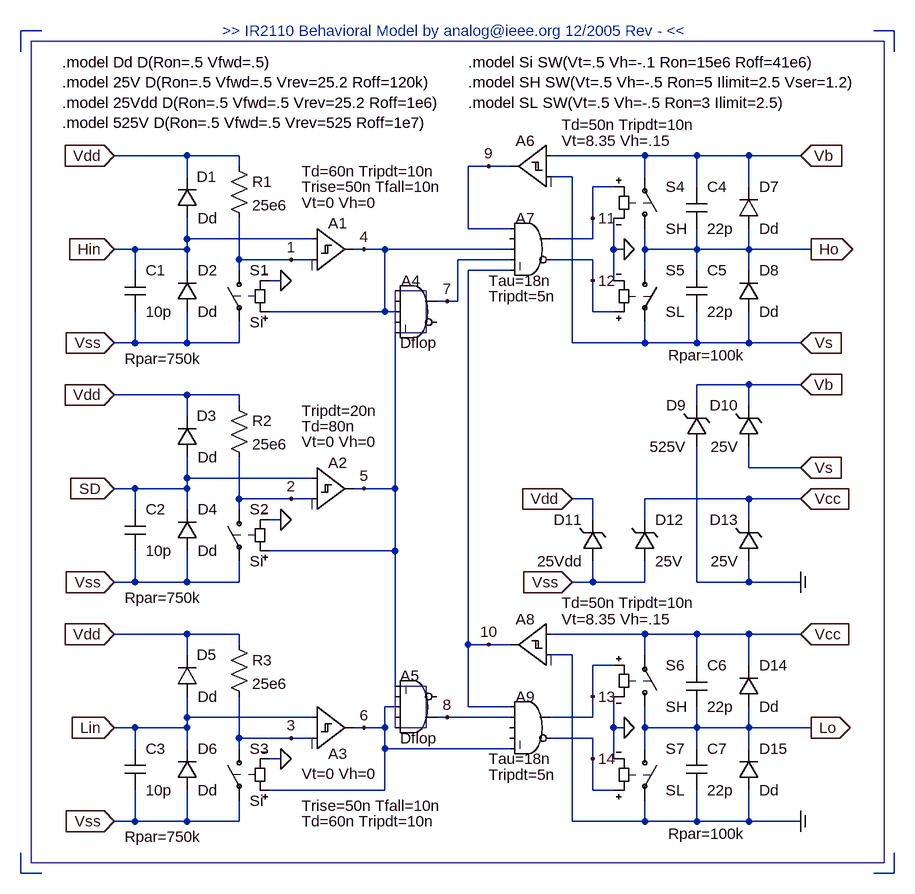
[diagram p0: schematic IR2110.asc]
IR2110.asc, the LTspice schematic file:
Version 4
SHEET 1 13828 1048
WIRE -496 -592 -496 -624
WIRE -496 672 -496 640
WIRE -464 -624 -496 -624
WIRE -464 672 -496 672
WIRE -320 -288 -352 -288
WIRE -320 -256 -320 -288
WIRE -320 -144 -352 -144
WIRE -320 -144 -320 -192
WIRE -320 80 -352 80
WIRE -320 112 -320 80
WIRE -320 224 -352 224
WIRE -320 224 -320 176
WIRE -320 448 -352 448
WIRE -320 480 -320 448
WIRE -320 592 -352 592
WIRE -320 592 -320 544
WIRE -240 -432 -352 -432
WIRE -240 -400 -240 -432
WIRE -240 -304 -240 -336
WIRE -240 -288 -320 -288
WIRE -240 -288 -240 -304
WIRE -240 -256 -240 -288
WIRE -240 -144 -320 -144
WIRE -240 -144 -240 -192
WIRE -240 -64 -352 -64
WIRE -240 -32 -240 -64
WIRE -240 64 -240 32
WIRE -240 80 -320 80
WIRE -240 80 -240 64
WIRE -240 112 -240 80
WIRE -240 224 -320 224
WIRE -240 224 -240 176
WIRE -240 304 -352 304
WIRE -240 336 -240 304
WIRE -240 432 -240 400
WIRE -240 448 -320 448
WIRE -240 448 -240 432
WIRE -240 480 -240 448
WIRE -240 592 -320 592
WIRE -240 592 -240 544
WIRE -160 -432 -240 -432
WIRE -160 -416 -160 -432
WIRE -160 -272 -160 -336
WIRE -160 -256 -160 -272
WIRE -160 -144 -240 -144
WIRE -160 -144 -160 -176
WIRE -160 -64 -240 -64
WIRE -160 -48 -160 -64
WIRE -160 96 -160 32
WIRE -160 112 -160 96
WIRE -160 224 -240 224
WIRE -160 224 -160 192
WIRE -160 304 -240 304
WIRE -160 320 -160 304
WIRE -160 464 -160 400
WIRE -160 480 -160 464
WIRE -160 592 -240 592
WIRE -160 592 -160 560
WIRE -96 -240 -112 -240
WIRE -96 128 -112 128
WIRE -96 496 -112 496
WIRE -80 -272 -160 -272
WIRE -80 96 -160 96
WIRE -80 464 -160 464
WIRE -48 -304 -240 -304
WIRE -48 -272 -80 -272
WIRE -48 64 -240 64
WIRE -48 96 -80 96
WIRE -48 432 -240 432
WIRE -48 464 -80 464
WIRE 32 -288 16 -288
WIRE 32 80 16 80
WIRE 32 448 16 448
WIRE 64 -288 32 -288
WIRE 64 -192 -112 -192
WIRE 64 -192 64 -288
WIRE 64 448 32 448
WIRE 64 448 64 416
WIRE 64 480 64 448
WIRE 64 544 -112 544
WIRE 64 544 64 480
WIRE 80 -192 64 -192
WIRE 80 80 32 80
WIRE 80 80 80 -160
WIRE 80 176 -112 176
WIRE 80 176 80 80
WIRE 80 384 80 176
WIRE 80 416 64 416
WIRE 160 -208 144 -208
WIRE 160 432 144 432
WIRE 176 -208 160 -208
WIRE 176 -208 176 -272
WIRE 192 -320 192 -416
WIRE 192 320 192 -256
WIRE 192 416 192 320
WIRE 224 -416 192 -416
WIRE 224 320 192 320
WIRE 256 -416 224 -416
WIRE 256 -320 192 -320
WIRE 256 -288 64 -288
WIRE 256 -272 176 -272
WIRE 256 -256 192 -256
WIRE 256 320 224 320
WIRE 256 416 192 416
WIRE 256 432 160 432
WIRE 256 480 64 480
WIRE 352 -400 320 -400
WIRE 352 -144 352 -400
WIRE 352 336 320 336
WIRE 352 592 352 336
WIRE 384 -336 384 -384
WIRE 384 -304 320 -304
WIRE 384 -304 384 -336
WIRE 384 -272 320 -272
WIRE 384 -240 384 -272
WIRE 384 -192 384 -240
WIRE 384 96 352 96
WIRE 384 128 384 96
WIRE 384 224 352 224
WIRE 384 224 384 192
WIRE 384 400 384 352
WIRE 384 432 320 432
WIRE 384 432 384 400
WIRE 384 464 320 464
WIRE 384 496 384 464
WIRE 384 544 384 496
WIRE 416 -384 384 -384
WIRE 416 -288 416 -336
WIRE 416 -240 416 -288
WIRE 416 -192 384 -192
WIRE 416 352 384 352
WIRE 416 448 416 400
WIRE 416 496 416 448
WIRE 416 544 384 544
WIRE 432 -288 416 -288
WIRE 432 448 416 448
WIRE 464 -432 320 -432
WIRE 464 -400 464 -432
WIRE 464 -288 464 -320
WIRE 464 -256 464 -288
WIRE 464 -144 352 -144
WIRE 464 -144 464 -176
WIRE 464 128 464 96
WIRE 464 224 384 224
WIRE 464 224 464 192
WIRE 464 304 320 304
WIRE 464 336 464 304
WIRE 464 448 464 416
WIRE 464 480 464 448
WIRE 464 592 352 592
WIRE 464 592 464 560
WIRE 544 -432 464 -432
WIRE 544 -384 544 -432
WIRE 544 -288 464 -288
WIRE 544 -288 544 -320
WIRE 544 -256 544 -288
WIRE 544 -144 464 -144
WIRE 544 -144 544 -192
WIRE 544 -48 544 -80
WIRE 544 224 544 16
WIRE 544 304 464 304
WIRE 544 352 544 304
WIRE 544 448 464 448
WIRE 544 448 544 416
WIRE 544 480 544 448
WIRE 544 592 464 592
WIRE 544 592 544 544
WIRE 624 -432 544 -432
WIRE 624 -384 624 -432
WIRE 624 -288 544 -288
WIRE 624 -288 624 -320
WIRE 624 -256 624 -288
WIRE 624 -144 544 -144
WIRE 624 -144 624 -192
WIRE 624 -80 544 -80
WIRE 624 -48 624 -80
WIRE 624 48 624 16
WIRE 624 96 464 96
WIRE 624 128 624 96
WIRE 624 224 544 224
WIRE 624 224 624 192
WIRE 624 304 544 304
WIRE 624 352 624 304
WIRE 624 448 544 448
WIRE 624 448 624 416
WIRE 624 480 624 448
WIRE 624 592 544 592
WIRE 624 592 624 544
WIRE 704 -432 624 -432
WIRE 704 -144 624 -144
WIRE 704 -80 624 -80
WIRE 704 48 624 48
WIRE 704 96 624 96
WIRE 704 224 624 224
WIRE 704 304 624 304
WIRE 704 592 624 592
WIRE 720 -288 624 -288
WIRE 720 448 624 448
WIRE 848 -624 816 -624
WIRE 848 -592 848 -624
WIRE 848 672 816 672
WIRE 848 672 848 640
FLAG 720 -288 Ho
IOPIN 720 -288 Out
FLAG 704 -432 Vb
IOPIN 704 -432 In
FLAG 704 -144 Vs
IOPIN 704 -144 In
FLAG 704 224 Com
IOPIN 704 224 In
FLAG 704 304 Vcc
IOPIN 704 304 In
FLAG 704 592 Com
IOPIN 704 592 In
FLAG 720 448 Lo
IOPIN 720 448 Out
FLAG 432 448 0
FLAG 432 -288 0
FLAG 160 432 8
FLAG 384 -336 11
FLAG 384 -240 12
FLAG 704 96 Vcc
IOPIN 704 96 In
FLAG 704 -80 Vb
IOPIN 704 -80 In
FLAG 704 48 Vs
IOPIN 704 48 In
FLAG 224 -416 9
FLAG 224 320 10
FLAG -352 -288 Hin
IOPIN -352 -288 In
FLAG -352 -432 Vdd
IOPIN -352 -432 In
FLAG -352 -144 Vss
IOPIN -352 -144 In
FLAG -352 80 SD
IOPIN -352 80 In
FLAG -352 -64 Vdd
IOPIN -352 -64 In
FLAG -352 224 Vss
IOPIN -352 224 In
FLAG -80 -272 1
FLAG -80 464 3
FLAG 32 -288 4
FLAG 32 80 5
FLAG 32 448 6
FLAG -352 448 Lin
IOPIN -352 448 In
FLAG -352 304 Vdd
IOPIN -352 304 In
FLAG -352 592 Vss
IOPIN -352 592 In
FLAG -96 -240 0
FLAG -96 128 0
FLAG -96 496 0
FLAG -80 96 2
FLAG 160 -208 7
FLAG 352 224 Vss
IOPIN 352 224 In
FLAG 352 96 Vdd
IOPIN 352 96 In
FLAG 384 400 13
FLAG 384 496 14
SYMBOL cap -336 -256 R0
WINDOW 0 32 0 Left 0
WINDOW 3 32 64 Left 0
WINDOW 39 0 136 Left 0
SYMATTR InstName C1
SYMATTR Value 10p
SYMATTR SpiceLine Rpar=750k
SYMBOL diode -256 -336 M180
WINDOW 0 31 64 Left 0
WINDOW 3 32 0 Left 0
SYMATTR InstName D1
SYMATTR Value Dd
SYMBOL diode -256 -192 M180
WINDOW 0 32 64 Left 0
WINDOW 3 32 0 Left 0
SYMATTR InstName D2
SYMATTR Value Dd
SYMBOL res -176 -432 R0
SYMATTR InstName R1
SYMATTR Value 25e6
SYMBOL sw -160 -272 M0
WINDOW 0 -16 16 Right 0
WINDOW 3 -16 96 Right 0
SYMATTR InstName S1
SYMATTR Value Si
SYMBOL Digital\\diffschmtbuf -48 -352 R0
WINDOW 0 40 24 Center 0
WINDOW 3 -16 -8 Left 0
WINDOW 123 -16 -32 Left 0
WINDOW 39 -16 -56 Left 0
SYMATTR InstName A1
SYMATTR Value Vt=0 Vh=0
SYMATTR Value2 Trise=50n Tfall=10n
SYMATTR SpiceLine Td=60n Tripdt=10n
SYMBOL cap -336 112 R0
WINDOW 0 32 0 Left 0
WINDOW 3 32 64 Left 0
WINDOW 39 0 136 Left 0
SYMATTR InstName C2
SYMATTR Value 10p
SYMATTR SpiceLine Rpar=750k
SYMBOL diode -256 32 M180
WINDOW 0 31 64 Left 0
WINDOW 3 32 0 Left 0
SYMATTR InstName D3
SYMATTR Value Dd
SYMBOL diode -256 176 M180
WINDOW 0 32 64 Left 0
WINDOW 3 32 0 Left 0
SYMATTR InstName D4
SYMATTR Value Dd
SYMBOL res -176 -64 R0
SYMATTR InstName R2
SYMATTR Value 25e6
SYMBOL sw -160 96 M0
WINDOW 0 -16 16 Right 0
WINDOW 3 -16 96 Right 0
SYMATTR InstName S2
SYMATTR Value Si
SYMBOL Digital\\diffschmtbuf -48 16 R0
WINDOW 3 -16 -8 Left 0
WINDOW 123 -16 -32 Left 0
WINDOW 39 -16 -56 Left 0
WINDOW 0 40 24 Center 0
SYMATTR Value Vt=0 Vh=0
SYMATTR Value2 Td=80n
SYMATTR SpiceLine Tripdt=20n
SYMATTR InstName A2
SYMBOL cap -336 480 R0
WINDOW 0 32 0 Left 0
WINDOW 3 32 64 Left 0
WINDOW 39 0 136 Left 0
SYMATTR InstName C3
SYMATTR Value 10p
SYMATTR SpiceLine Rpar=750k
SYMBOL diode -256 400 M180
WINDOW 0 31 64 Left 0
WINDOW 3 32 0 Left 0
SYMATTR InstName D5
SYMATTR Value Dd
SYMBOL diode -256 544 M180
WINDOW 0 32 64 Left 0
WINDOW 3 32 0 Left 0
SYMATTR InstName D6
SYMATTR Value Dd
SYMBOL res -176 304 R0
SYMATTR InstName R3
SYMATTR Value 25e6
SYMBOL sw -160 464 M0
WINDOW 0 -16 16 Right 0
WINDOW 3 -16 96 Right 0
SYMATTR InstName S3
SYMATTR Value Si
SYMBOL Digital\\diffschmtbuf -48 384 R0
WINDOW 0 40 104 Center 0
WINDOW 3 -16 135 Left 0
WINDOW 123 -16 184 Left 0
WINDOW 39 -16 208 Left 0
SYMATTR InstName A3
SYMATTR Value Vt=0 Vh=0
SYMATTR Value2 Trise=50n Tfall=10n
SYMATTR SpiceLine Td=60n Tripdt=10n
SYMBOL Digital\\and 112 -256 R0
WINDOW 0 -23 16 Left 0
WINDOW 38 -24 112 Left 0
WINDOW 3 -24 136 Left 0
SYMATTR InstName A4
SYMATTR SpiceModel Dflop
SYMBOL Digital\\and 112 480 M180
WINDOW 0 -24 112 Left 0
WINDOW 38 -24 16 Left 0
WINDOW 3 -24 136 Left 0
SYMATTR InstName A5
SYMATTR SpiceModel Dflop
SYMBOL Digital\\diffschmtbuf 320 -480 M0
WINDOW 0 40 25 Center 0
WINDOW 3 -16 25 Right 0
WINDOW 123 -16 0 Right 0
SYMATTR InstName A6
SYMATTR Value Vt=8.35 Vh=.15
SYMATTR Value2 Td=50n Tripdt=10n
SYMBOL Digital\\and 288 -352 R0
WINDOW 0 -8 16 Center 0
WINDOW 3 -64 112 Left 0
WINDOW 123 -64 136 Left 0
SYMATTR InstName A7
SYMATTR Value Tau=18n
SYMATTR Value2 Tripdt=5n
SYMBOL sw 464 -304 M180
WINDOW 0 32 80 Left 0
WINDOW 3 32 16 Left 0
SYMATTR InstName S4
SYMATTR Value SH
SYMBOL sw 464 -272 R0
WINDOW 0 32 16 Left 0
WINDOW 3 32 80 Left 0
SYMATTR InstName S5
SYMATTR Value SL
SYMBOL cap 528 -384 R0
WINDOW 0 32 0 Left 0
WINDOW 3 32 64 Left 0
SYMATTR InstName C4
SYMATTR Value 22p
SYMBOL cap 528 -256 R0
WINDOW 0 32 0 Left 0
WINDOW 3 32 64 Left 0
WINDOW 39 32 131 Center 0
SYMATTR InstName C5
SYMATTR Value 22p
SYMATTR SpiceLine Rpar=100k
SYMBOL diode 608 -320 M180
WINDOW 0 32 64 Left 0
WINDOW 3 32 0 Left 0
SYMATTR InstName D7
SYMATTR Value Dd
SYMBOL diode 608 -192 M180
WINDOW 0 32 64 Left 0
WINDOW 3 32 0 Left 0
SYMATTR InstName D8
SYMATTR Value Dd
SYMBOL zener 528 16 M180
WINDOW 0 0 64 Right 0
WINDOW 3 0 0 Right 0
SYMATTR InstName D9
SYMATTR Value 525V
SYMBOL zener 608 16 M180
WINDOW 0 0 64 Right 0
WINDOW 3 0 0 Right 0
SYMATTR InstName D10
SYMATTR Value 25V
SYMBOL zener 368 192 M180
WINDOW 0 0 64 Right 0
WINDOW 3 0 0 Right 0
SYMATTR InstName D11
SYMATTR Value 25Vdd
SYMBOL zener 448 192 M180
WINDOW 0 32 64 Left 0
WINDOW 3 32 0 Left 0
SYMATTR InstName D12
SYMATTR Value 25V
SYMBOL zener 608 192 M180
WINDOW 0 0 64 Right 0
WINDOW 3 0 0 Right 0
SYMATTR InstName D13
SYMATTR Value 25V
SYMBOL Digital\\diffschmtbuf 320 256 M0
WINDOW 0 40 25 Center 0
WINDOW 3 -16 25 Right 0
WINDOW 123 -16 0 Right 0
SYMATTR InstName A8
SYMATTR Value Vt=8.35 Vh=.15
SYMATTR Value2 Td=50n Tripdt=10n
SYMBOL Digital\\and 288 384 R0
WINDOW 0 -8 16 Center 0
WINDOW 3 -64 112 Left 0
WINDOW 123 -64 136 Left 0
SYMATTR InstName A9
SYMATTR Value Tau=18n
SYMATTR Value2 Tripdt=5n
SYMBOL sw 464 432 M180
WINDOW 0 32 80 Left 0
WINDOW 3 32 16 Left 0
SYMATTR InstName S6
SYMATTR Value SH
SYMBOL sw 464 464 R0
WINDOW 0 32 16 Left 0
WINDOW 3 32 80 Left 0
SYMATTR InstName S7
SYMATTR Value SL
SYMBOL cap 528 352 R0
WINDOW 0 32 0 Left 0
WINDOW 3 32 64 Left 0
SYMATTR InstName C6
SYMATTR Value 22p
SYMBOL cap 528 480 R0
WINDOW 0 32 0 Left 0
WINDOW 3 32 64 Left 0
WINDOW 39 32 131 Center 0
SYMATTR InstName C7
SYMATTR Value 22p
SYMATTR SpiceLine Rpar=100k
SYMBOL diode 608 416 M180
WINDOW 0 32 64 Left 0
WINDOW 3 32 0 Left 0
SYMATTR InstName D14
SYMATTR Value Dd
SYMBOL diode 608 544 M180
WINDOW 0 32 64 Left 0
WINDOW 3 32 0 Left 0
SYMATTR InstName D15
SYMATTR Value Dd
TEXT 176 -624 Center 0 ;>> IR2110 Behavioral Model by analog@ieee.org 12/2005 Rev - <<
TEXT -432 -576 Left 0 !.model Dd D(Ron=.5 Vfwd=.5)\n.model 25V D(Ron=.5 Vfwd=.5 Vrev=25.2 Roff=120k)\n.model 25Vdd D(Ron=.5 Vfwd=.5 Vrev=25.2 Roff=1e6)\n.model 525V D(Ron=.5 Vfwd=.5 Vrev=525 Roff=1e7)
TEXT 192 -576 Left 0 !.model Si SW(Vt=.5 Vh=-.1 Ron=15e6 Roff=41e6)\n.model SH SW(Vt=.5 Vh=-.5 Ron=5 Ilimit=2.5 Vser=1.2)\n.model SL SW(Vt=.5 Vh=-.5 Ron=3 Ilimit=2.5)
RECTANGLE Normal 832 656 -480 -608
RECTANGLE Normal 128 -160 80 -224
RECTANGLE Normal 128 448 80 384

The netlist it stands for:
* IR2110.asc
C1 Hin Vss 10p Rpar=750k
D1 Hin Vdd Dd
D2 Vss Hin Dd
R1 Vdd 1 25e6
S1 1 Vss 4 0 Si
A1 Hin 1 0 0 0 0 4 0 SCHMITT Vt=0 Vh=0 Trise=50n Tfall=10n Td=60n Tripdt=10n
C2 SD Vss 10p Rpar=750k
D3 SD Vdd Dd
D4 Vss SD Dd
R2 Vdd 2 25e6
S2 2 Vss 5 0 Si
A2 SD 2 0 0 0 0 5 0 SCHMITT Vt=0 Vh=0 Td=80n Tripdt=20n
C3 Lin Vss 10p Rpar=750k
D5 Lin Vdd Dd
D6 Vss Lin Dd
R3 Vdd 3 25e6
S3 3 Vss 6 0 Si
A3 Lin 3 0 0 0 0 6 0 SCHMITT Vt=0 Vh=0 Trise=50n Tfall=10n Td=60n Tripdt=10n
A4 0 0 4 0 5 0 7 0 Dflop
A5 0 0 6 0 5 0 8 0 Dflop
A6 Vb Vs 0 0 0 0 9 0 SCHMITT Vt=8.35 Vh=.15 Td=50n Tripdt=10n
A7 9 0 4 7 10 12 11 0 AND Tau=18n Tripdt=5n
S4 Ho Vb 11 0 SH
S5 Ho Vs 12 0 SL
C4 Vb Ho 22p
C5 Ho Vs 22p Rpar=100k
D7 Ho Vb Dd
D8 Vs Ho Dd
D9 Com Vb 525V
D10 Vs Vb 25V
D11 Vss Vdd 25Vdd
D12 Vss Vcc 25V
D13 Com Vcc 25V
A8 Vcc Com 0 0 0 0 10 0 SCHMITT Vt=8.35 Vh=.15 Td=50n Tripdt=10n
A9 10 8 0 0 6 14 13 0 AND Tau=18n Tripdt=5n
S6 Lo Vcc 13 0 SH
S7 Lo Com 14 0 SL
C6 Vcc Lo 22p
C7 Lo Com 22p Rpar=100k
D14 Lo Vcc Dd
D15 Com Lo Dd
.model D D
.lib standard.dio
* >> IR2110 Behavioral Model by analog@ieee.org 12/2005 Rev - <<
.model Dd D(Ron=.5 Vfwd=.5)
.model 25V D(Ron=.5 Vfwd=.5 Vrev=25.2 Roff=120k)
.model 25Vdd D(Ron=.5 Vfwd=.5 Vrev=25.2 Roff=1e6)
.model 525V D(Ron=.5 Vfwd=.5 Vrev=525 Roff=1e7)
.model Si SW(Vt=.5 Vh=-.1 Ron=15e6 Roff=41e6)
.model SH SW(Vt=.5 Vh=-.5 Ron=5 Ilimit=2.5 Vser=1.2)
.model SL SW(Vt=.5 Vh=-.5 Ron=3 Ilimit=2.5)
.backanno
.end